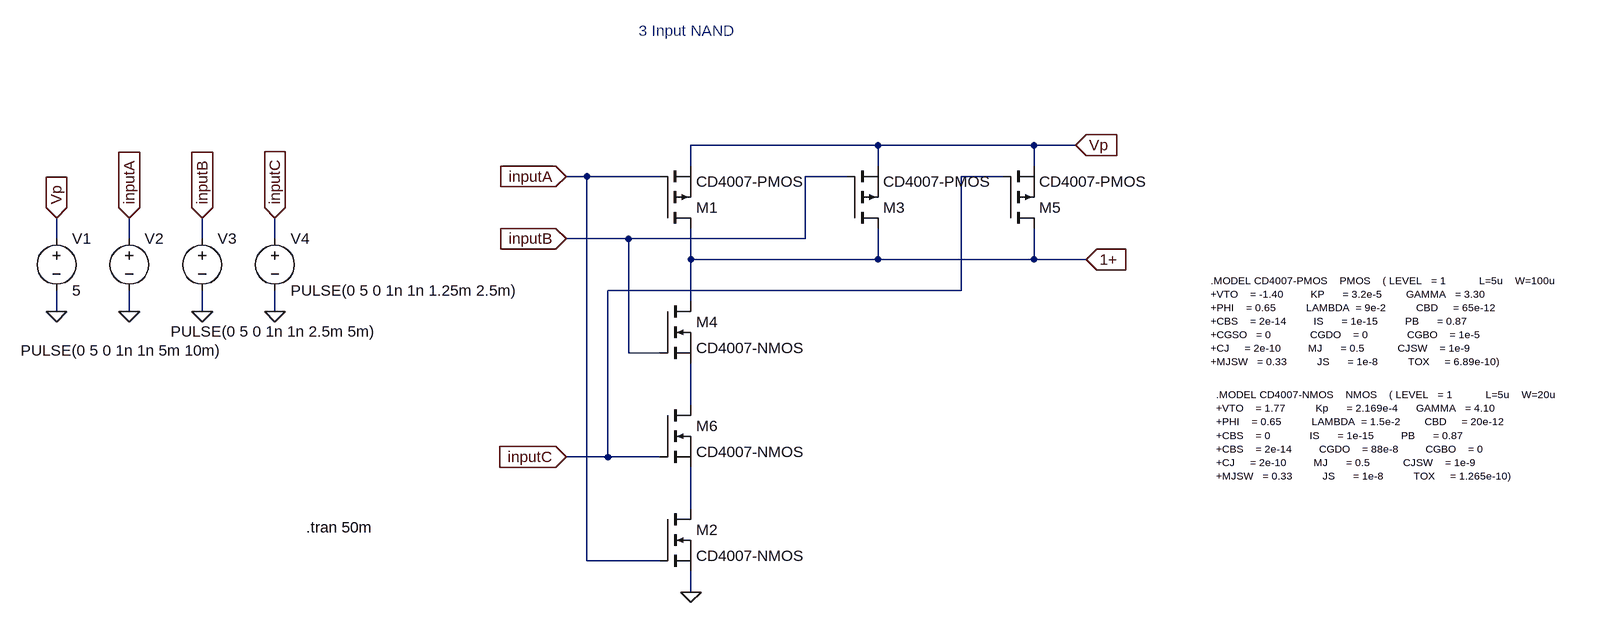
[diagram p0: schematic three_in_nand_ltspice.asc]
three_in_nand_ltspice.asc, the LTspice schematic file:
Version 4
SHEET 1 1176 680
WIRE -512 -160 -800 -160
WIRE -272 -160 -512 -160
WIRE -208 -160 -272 -160
WIRE -800 -128 -800 -160
WIRE -512 -128 -512 -160
WIRE -272 -128 -272 -160
WIRE -960 -112 -992 -112
WIRE -848 -112 -960 -112
WIRE -560 -112 -624 -112
WIRE -320 -112 -384 -112
WIRE -1776 -16 -1776 -48
WIRE -1664 -16 -1664 -48
WIRE -1552 -16 -1552 -48
WIRE -1440 -16 -1440 -48
WIRE -896 -16 -992 -16
WIRE -624 -16 -624 -112
WIRE -624 -16 -896 -16
WIRE -800 16 -800 -32
WIRE -512 16 -512 -32
WIRE -512 16 -800 16
WIRE -272 16 -272 -32
WIRE -272 16 -512 16
WIRE -192 16 -272 16
WIRE -384 64 -384 -112
WIRE -384 64 -928 64
WIRE -800 80 -800 16
WIRE -1776 96 -1776 64
WIRE -1664 96 -1664 64
WIRE -1552 96 -1552 64
WIRE -1440 96 -1440 64
WIRE -896 160 -896 -16
WIRE -848 160 -896 160
WIRE -800 240 -800 176
WIRE -928 320 -928 64
WIRE -928 320 -992 320
WIRE -848 320 -928 320
WIRE -800 400 -800 336
WIRE -960 480 -960 -112
WIRE -848 480 -960 480
WIRE -800 528 -800 496
FLAG -800 528 0
FLAG -992 -112 inputA
IOPIN -992 -112 In
FLAG -992 -16 inputB
IOPIN -992 -16 In
FLAG -1776 96 0
FLAG -1664 96 0
FLAG -1552 96 0
FLAG -1776 -48 Vp
IOPIN -1776 -48 In
FLAG -1664 -48 inputA
IOPIN -1664 -48 In
FLAG -1552 -48 inputB
IOPIN -1552 -48 In
FLAG -208 -160 Vp
IOPIN -208 -160 In
FLAG -192 16 1+
IOPIN -192 16 In
FLAG -992 320 inputC
IOPIN -992 320 In
FLAG -1440 96 0
FLAG -1440 -48 inputC
IOPIN -1440 -48 In
SYMBOL pmos -848 -32 M180
SYMATTR InstName M1
SYMATTR Value CD4007-PMOS
SYMBOL nmos -848 400 R0
SYMATTR InstName M2
SYMATTR Value CD4007-NMOS
SYMBOL pmos -560 -32 M180
SYMATTR InstName M3
SYMATTR Value CD4007-PMOS
SYMBOL nmos -848 80 R0
SYMATTR InstName M4
SYMATTR Value CD4007-NMOS
SYMBOL voltage -1776 -32 R0
WINDOW 123 0 0 Left 0
WINDOW 39 0 0 Left 0
SYMATTR InstName V1
SYMATTR Value 5
SYMBOL voltage -1664 -32 R0
WINDOW 3 -167 188 Left 2
WINDOW 123 0 0 Left 0
WINDOW 39 0 0 Left 0
SYMATTR InstName V2
SYMATTR Value PULSE(0 5 0 1n 1n 5m 10m)
SYMBOL voltage -1552 -32 R0
WINDOW 3 -48 159 Left 2
WINDOW 123 0 0 Left 0
WINDOW 39 0 0 Left 0
SYMATTR InstName V3
SYMATTR Value PULSE(0 5 0 1n 1n 2.5m 5m)
SYMBOL pmos -320 -32 M180
SYMATTR InstName M5
SYMATTR Value CD4007-PMOS
SYMBOL nmos -848 240 R0
SYMATTR InstName M6
SYMATTR Value CD4007-NMOS
SYMBOL voltage -1440 -32 R0
WINDOW 123 0 0 Left 0
WINDOW 39 0 0 Left 0
SYMATTR InstName V4
SYMATTR Value PULSE(0 5 0 1n 1n 1.25m 2.5m)
TEXT 0 48 Left 1 !.MODEL CD4007-PMOS    PMOS    ( LEVEL   = 1           L=5u    W=100u                \n+VTO    = -1.40         KP      = 3.2e-5        GAMMA   = 3.30  \n+PHI    = 0.65          LAMBDA  = 9e-2          CBD     = 65e-12\n+CBS    = 2e-14         IS      = 1e-15         PB      = 0.87\n+CGSO   = 0             CGDO    = 0             CGBO    = 1e-5\n+CJ     = 2e-10         MJ      = 0.5           CJSW    = 1e-9\n+MJSW   = 0.33          JS      = 1e-8          TOX     = 6.89e-10)
TEXT 8 224 Left 1 !.MODEL CD4007-NMOS    NMOS    ( LEVEL   = 1           L=5u    W=20u             \n+VTO    = 1.77          Kp      = 2.169e-4      GAMMA   = 4.10  \n+PHI    = 0.65          LAMBDA  = 1.5e-2        CBD     = 20e-12\n+CBS    = 0             IS      = 1e-15         PB      = 0.87\n+CBS    = 2e-14         CGDO    = 88e-8         CGBO    = 0\n+CJ     = 2e-10         MJ      = 0.5           CJSW    = 1e-9\n+MJSW   = 0.33          JS      = 1e-8          TOX     = 1.265e-10)
TEXT -1392 428 Left 2 !.tran 50m
TEXT -880 -336 Left 2 ;3 Input NAND

The netlist it stands for:
* three_in_nand_ltspice.asc
M1 1+ inputA Vp Vp CD4007-PMOS
M2 N002 inputA 0 0 CD4007-NMOS
M3 1+ inputB Vp Vp CD4007-PMOS
M4 1+ inputB N001 N001 CD4007-NMOS
V1 Vp 0 5
V2 inputA 0 PULSE(0 5 0 1n 1n 5m 10m)
V3 inputB 0 PULSE(0 5 0 1n 1n 2.5m 5m)
M5 1+ inputC Vp Vp CD4007-PMOS
M6 N001 inputC N002 N002 CD4007-NMOS
V4 inputC 0 PULSE(0 5 0 1n 1n 1.25m 2.5m)
.model NMOS NMOS
.model PMOS PMOS
.lib standard.mos
.MODEL CD4007-PMOS    PMOS    ( LEVEL   = 1           L=5u    W=100u
+VTO    = -1.40         KP      = 3.2e-5        GAMMA   = 3.30
+PHI    = 0.65          LAMBDA  = 9e-2          CBD     = 65e-12
+CBS    = 2e-14         IS      = 1e-15         PB      = 0.87
+CGSO   = 0             CGDO    = 0             CGBO    = 1e-5
+CJ     = 2e-10         MJ      = 0.5           CJSW    = 1e-9
+MJSW   = 0.33          JS      = 1e-8          TOX     = 6.89e-10)
.MODEL CD4007-NMOS    NMOS    ( LEVEL   = 1           L=5u    W=20u
+VTO    = 1.77          Kp      = 2.169e-4      GAMMA   = 4.10
+PHI    = 0.65          LAMBDA  = 1.5e-2        CBD     = 20e-12
+CBS    = 0             IS      = 1e-15         PB      = 0.87
+CBS    = 2e-14         CGDO    = 88e-8         CGBO    = 0
+CJ     = 2e-10         MJ      = 0.5           CJSW    = 1e-9
+MJSW   = 0.33          JS      = 1e-8          TOX     = 1.265e-10)
.tran 50m
* 3 Input NAND
.backanno
.end